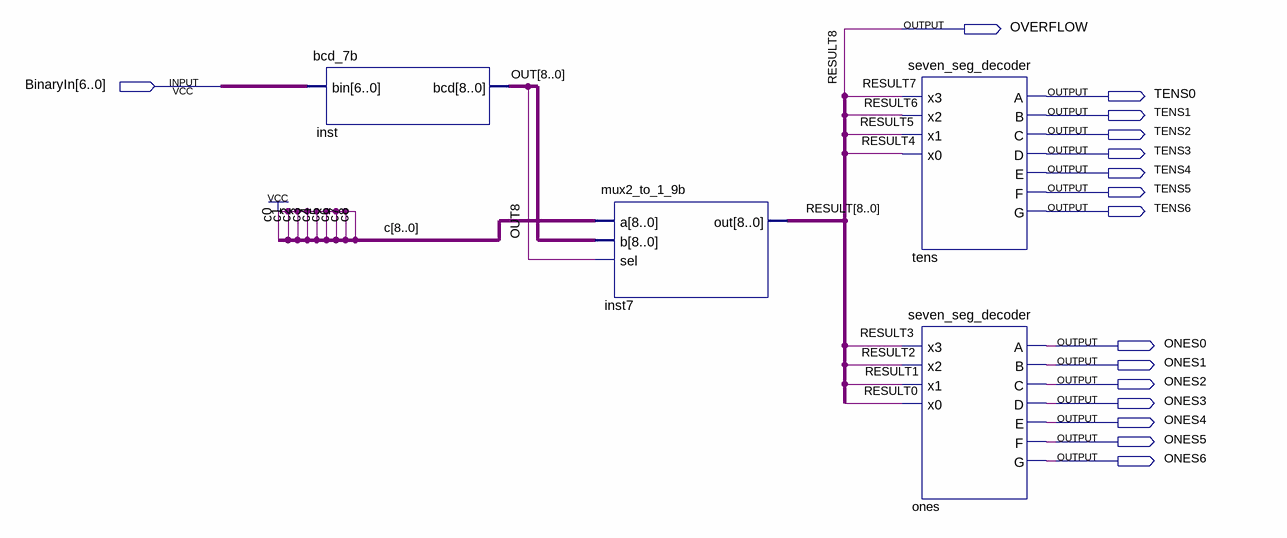
[diagram p0: schematic sheet]
// Quartus schematic binaryDisplay.bdf as structural Verilog: 4 symbols, 16 pins
module binaryDisplay (
  input  [6:0] BinaryIn,
  output OVERFLOW,
  output TENS0,
  output TENS1,
  output TENS2,
  output TENS3,
  output TENS4,
  output TENS5,
  output TENS6,
  output ONES0,
  output ONES1,
  output ONES2,
  output ONES3,
  output ONES4,
  output ONES5,
  output ONES6
);

  wire [7:0] RESULT;
  wire [8:0] OUT;

  bcd_7b inst (.bin(BinaryIn), .bcd(OUT));
  mux2_to_1_9b inst7 (.a({9{1'b1}}), .b(OUT), .sel(OUT[8]), .out({OVERFLOW, RESULT}));
  seven_seg_decoder tens (
    .x3(RESULT[7]), .x2(RESULT[6]), .x1(RESULT[5]), .x0(RESULT[4]), .A(TENS0), .B(TENS1), .C(TENS2),
    .D(TENS3), .E(TENS4), .F(TENS5), .G(TENS6));
  seven_seg_decoder ones (
    .x3(RESULT[3]), .x2(RESULT[2]), .x1(RESULT[1]), .x0(RESULT[0]), .A(ONES0), .B(ONES1), .C(ONES2),
    .D(ONES3), .E(ONES4), .F(ONES5), .G(ONES6));

  // Other names for the same wires on the sheet: RESULT[8] = OVERFLOW; RESULT8 = OVERFLOW
endmodule
